# Altium schematic sheet Zynq_Power.SchDoc
size A3
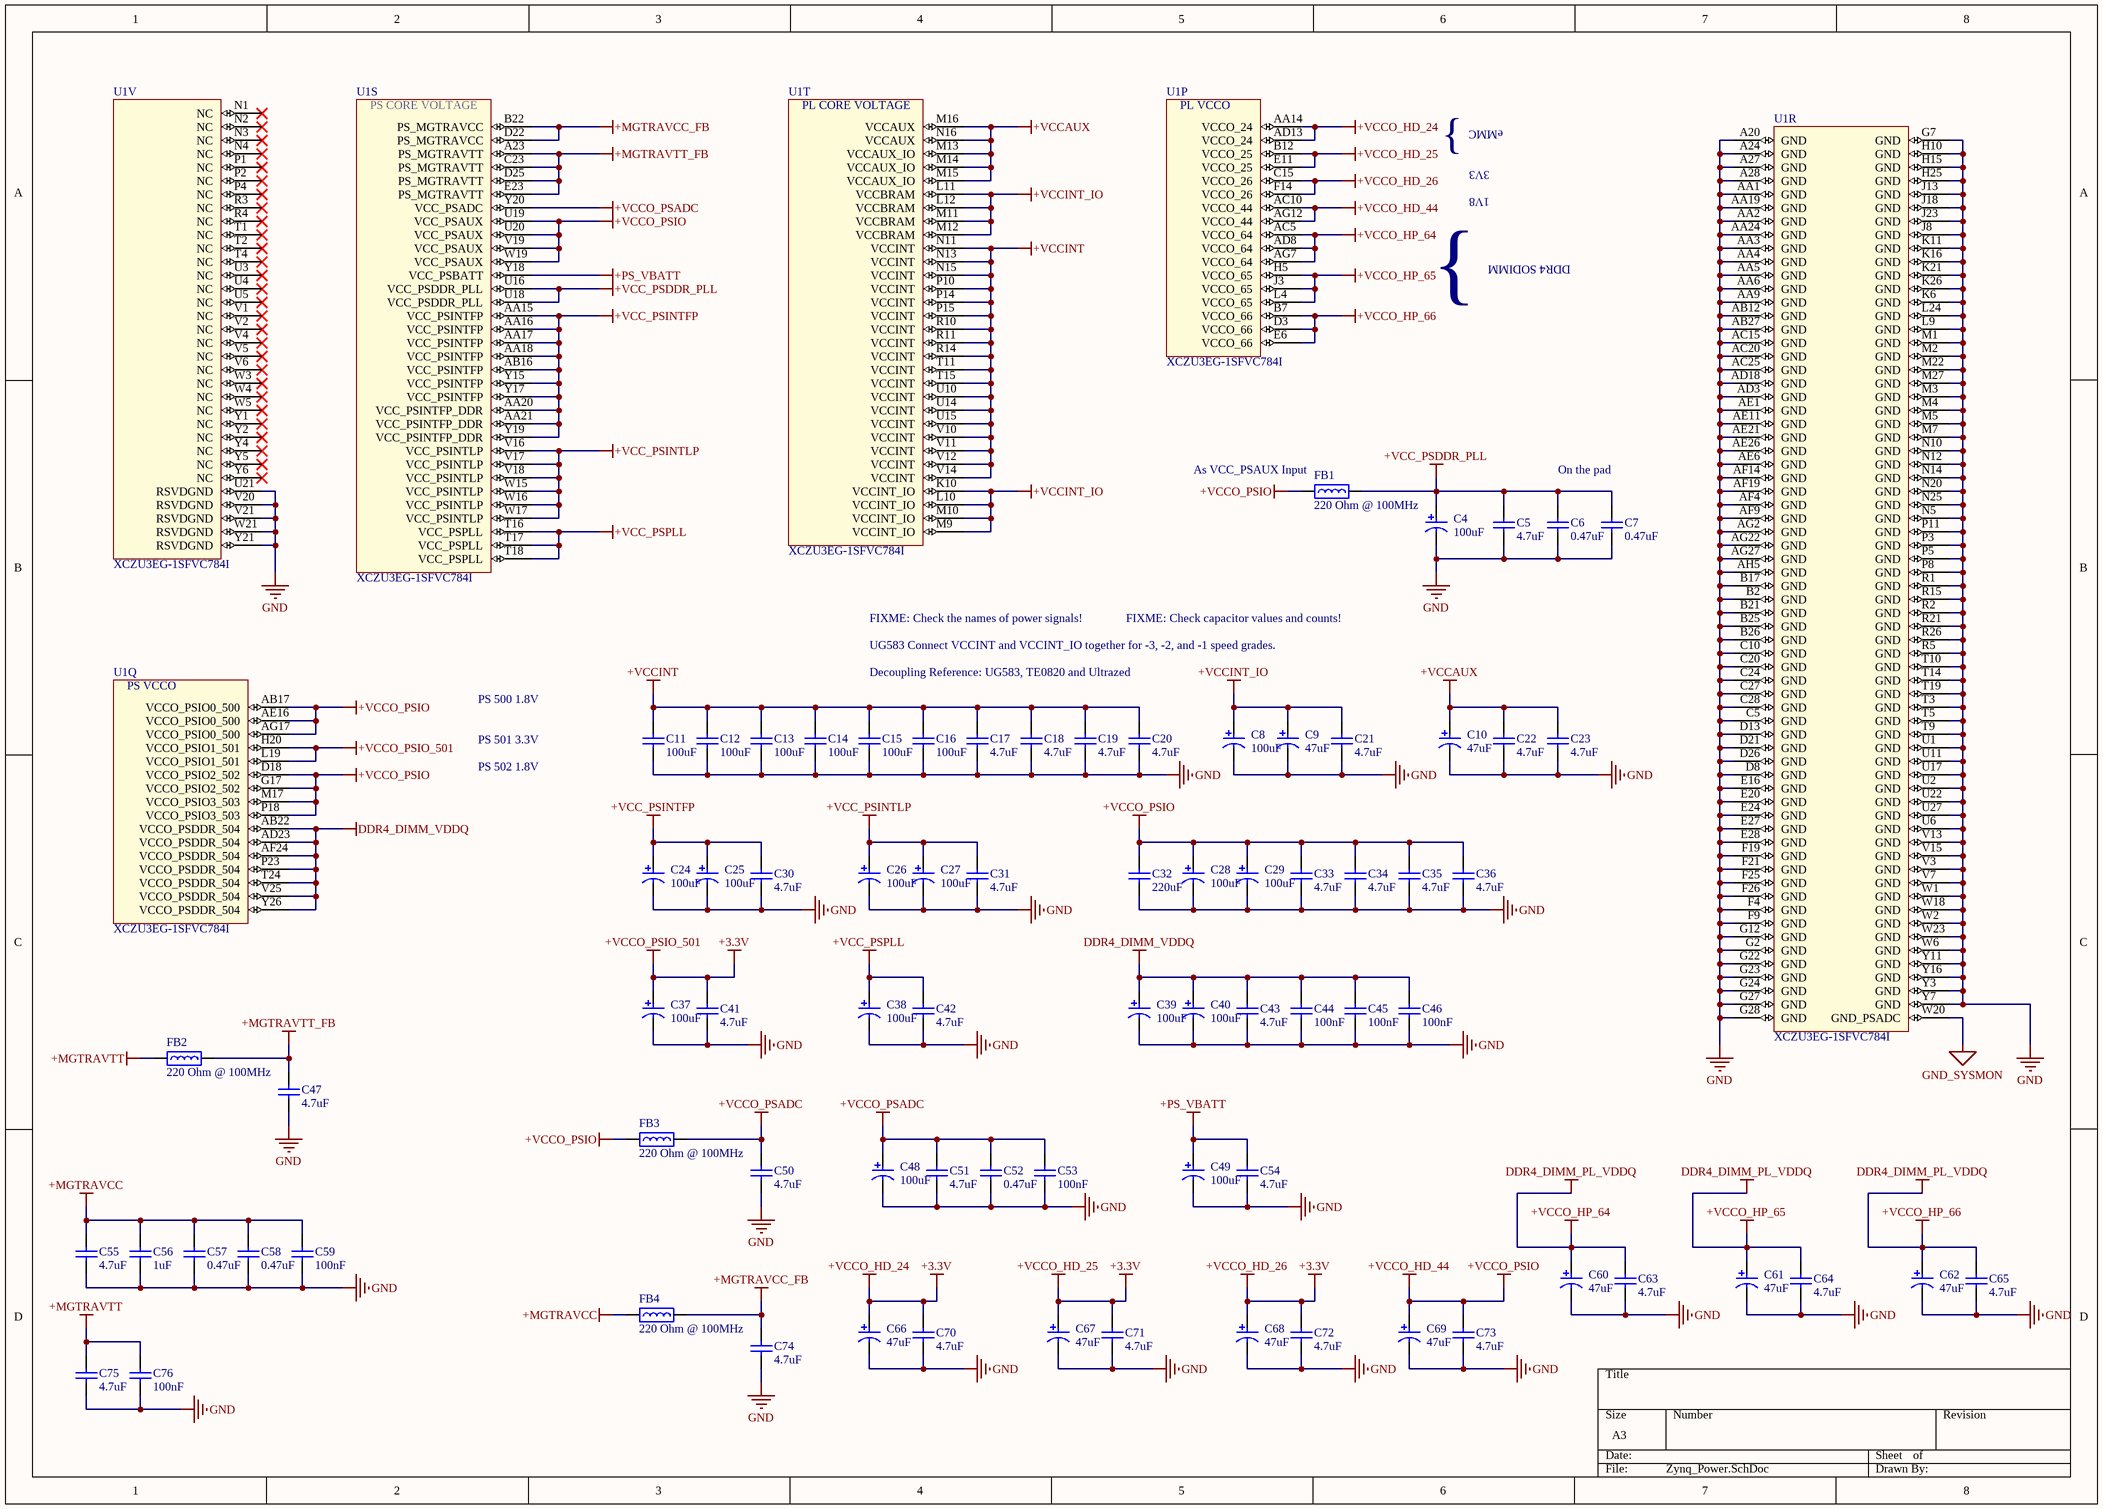
[diagram p0: Zynq_Power.SchDoc]

## Parts
C4  100uF  [AVX_TAN_F95_P_0905]
C5  4.7uF  [CAPC1005L_0402]
C6  0.47uF  [CAPC1005L_0402]
C7  0.47uF  [CAPC1005L_0402]
C8  100uF  [AVX_TAN_F95_P_0905]
C9  47uF  [AVX_TAN_F38_M_0603]
C10  47uF  [AVX_TAN_F38_M_0603]
C11  100uF  [CAPC3225N_1210]
C12  100uF  [CAPC3225N_1210]
C13  100uF  [CAPC3225N_1210]
C14  100uF  [CAPC3225N_1210]
C15  100uF  [CAPC3225N_1210]
C16  100uF  [CAPC3225N_1210]
C17  4.7uF  [CAPC1005L_0402]
C18  4.7uF  [CAPC1005L_0402]
C19  4.7uF  [CAPC1005L_0402]
C20  4.7uF  [CAPC1005L_0402]
C21  4.7uF  [CAPC1005L_0402]
C22  4.7uF  [CAPC1005L_0402]
C23  4.7uF  [CAPC1005L_0402]
C24  100uF  [AVX_TAN_F95_P_0905]
C25  100uF  [AVX_TAN_F95_P_0905]
C26  100uF  [AVX_TAN_F95_P_0905]
C27  100uF  [AVX_TAN_F95_P_0905]
C28  100uF  [AVX_TAN_F95_P_0905]
C29  100uF  [AVX_TAN_F95_P_0905]
C30  4.7uF  [CAPC1005L_0402]
C31  4.7uF  [CAPC1005L_0402]
C32  220uF  [CAPC3225N_1210]
C33  4.7uF  [CAPC1005L_0402]
C34  4.7uF  [CAPC1005L_0402]
C35  4.7uF  [CAPC1005L_0402]
C36  4.7uF  [CAPC1005L_0402]
C37  100uF  [AVX_TAN_F95_P_0905]
C38  100uF  [AVX_TAN_F95_P_0905]
C39  100uF  [AVX_TAN_F95_P_0905]
C40  100uF  [AVX_TAN_F95_P_0905]
C41  4.7uF  [CAPC1005L_0402]
C42  4.7uF  [CAPC1005L_0402]
C43  4.7uF  [CAPC1005L_0402]
C44  100nF  [CAPC1005L_0402]
C45  100nF  [CAPC1005L_0402]
C46  100nF  [CAPC1005L_0402]
C47  4.7uF  [CAPC1005L_0402]
C48  100uF  [AVX_TAN_F95_P_0905]
C49  100uF  [AVX_TAN_F95_P_0905]
C50  4.7uF  [CAPC1005L_0402]
C51  4.7uF  [CAPC1005L_0402]
C52  0.47uF  [CAPC1005L_0402]
C53  100nF  [CAPC1005L_0402]
C54  4.7uF  [CAPC1005L_0402]
C55  4.7uF  [CAPC1005L_0402]
C56  1uF  [CAPC1005L_0402]
C57  0.47uF  [CAPC1005L_0402]
C58  0.47uF  [CAPC1005L_0402]
C59  100nF  [CAPC1005L_0402]
C60  47uF  [AVX_TAN_F38_M_0603]
C61  47uF  [AVX_TAN_F38_M_0603]
C62  47uF  [AVX_TAN_F38_M_0603]
C63  4.7uF  [CAPC1005L_0402]
C64  4.7uF  [CAPC1005L_0402]
C65  4.7uF  [CAPC1005L_0402]
C66  47uF  [AVX_TAN_F38_M_0603]
C67  47uF  [AVX_TAN_F38_M_0603]
C68  47uF  [AVX_TAN_F38_M_0603]
C69  47uF  [AVX_TAN_F38_M_0603]
C70  4.7uF  [CAPC1005L_0402]
C71  4.7uF  [CAPC1005L_0402]
C72  4.7uF  [CAPC1005L_0402]
C73  4.7uF  [CAPC1005L_0402]
C74  4.7uF  [CAPC1005L_0402]
C75  4.7uF  [CAPC1005L_0402]
C76  100nF  [CAPC1005L_0402]
FB1  Impedance @ Frequency: 220 Ohm @ 100MHz  [INDC1608N_0603]  (hidden comment: BEAD0603_220_2A5_40M)
FB2  Impedance @ Frequency: 220 Ohm @ 100MHz  [INDC1608N_0603]  (hidden comment: BEAD0603_220_2A5_40M)
FB3  Impedance @ Frequency: 220 Ohm @ 100MHz  [INDC1608N_0603]  (hidden comment: BEAD0603_220_2A5_40M)
FB4  Impedance @ Frequency: 220 Ohm @ 100MHz  [INDC1608N_0603]  (hidden comment: BEAD0603_220_2A5_40M)
U1  XCZU3EG-1SFVC784I  [BGA784x28]  (parts P,Q,R,S,T,V of 22)

## Nets
+3.3V: C37.1 C41.1 C66.1 C67.1 C68.1 C70.1 C71.1 C72.1 U1.AA14(VCCO_24) U1.AD13(VCCO_24) U1.B12(VCCO_25) U1.C15(VCCO_26) U1.E11(VCCO_25) U1.F14(VCCO_26) U1.H20(VCCO_PSIO1_501) U1.L19(VCCO_PSIO1_501)  [also labelled +VCCO_HD_24, +VCCO_HD_25, +VCCO_HD_26, +VCCO_PSIO_501]
+MGTRAVCC: C55.1 C56.2 C57.2 C58.2 C59.2 FB4.1
+MGTRAVCC_FB: C74.1 FB4.2 U1.B22(PS_MGTRAVCC) U1.D22(PS_MGTRAVCC)
+MGTRAVTT: C75.1 C76.2 FB2.1
+MGTRAVTT_FB: C47.1 FB2.2 U1.A23(PS_MGTRAVTT) U1.C23(PS_MGTRAVTT) U1.D25(PS_MGTRAVTT) U1.E23(PS_MGTRAVTT)
+PS_VBATT: C49.1 C54.1 U1.Y18(VCC_PSBATT)
+VCC_PSDDR_PLL: C4.1 C5.1 C6.2 C7.2 FB1.2 U1.U16(VCC_PSDDR_PLL) U1.U18(VCC_PSDDR_PLL)
+VCC_PSINTFP: C24.1 C25.1 C30.1 U1.AA15(VCC_PSINTFP) U1.AA16(VCC_PSINTFP) U1.AA17(VCC_PSINTFP) U1.AA18(VCC_PSINTFP) U1.AA20(VCC_PSINTFP_DDR) U1.AA21(VCC_PSINTFP_DDR) U1.AB16(VCC_PSINTFP) U1.Y15(VCC_PSINTFP) U1.Y17(VCC_PSINTFP) U1.Y19(VCC_PSINTFP_DDR)
+VCC_PSINTLP: C26.1 C27.1 C31.1 U1.V16(VCC_PSINTLP) U1.V17(VCC_PSINTLP) U1.V18(VCC_PSINTLP) U1.W15(VCC_PSINTLP) U1.W16(VCC_PSINTLP) U1.W17(VCC_PSINTLP)
+VCC_PSPLL: C38.1 C42.1 U1.T16(VCC_PSPLL) U1.T17(VCC_PSPLL) U1.T18(VCC_PSPLL)
+VCCAUX: C10.1 C22.1 C23.1 U1.M13(VCCAUX_IO) U1.M14(VCCAUX_IO) U1.M15(VCCAUX_IO) U1.M16(VCCAUX) U1.N16(VCCAUX)
+VCCINT: C11.2 C12.2 C13.2 C14.2 C15.2 C16.2 C17.2 C18.2 C19.2 C20.2 U1.N11(VCCINT) U1.N13(VCCINT) U1.N15(VCCINT) U1.P10(VCCINT) U1.P14(VCCINT) U1.P15(VCCINT) U1.R10(VCCINT) U1.R11(VCCINT) U1.R14(VCCINT) U1.T11(VCCINT) U1.T15(VCCINT) U1.U10(VCCINT) U1.U14(VCCINT) U1.U15(VCCINT) U1.V10(VCCINT) U1.V11(VCCINT) U1.V12(VCCINT) U1.V14(VCCINT)
+VCCINT_IO: C8.1 C9.1 C21.1 U1.K10(VCCINT_IO) U1.L10(VCCINT_IO) U1.L11(VCCBRAM) U1.L12(VCCBRAM) U1.M9(VCCINT_IO) U1.M10(VCCINT_IO) U1.M11(VCCBRAM) U1.M12(VCCBRAM)
+VCCO_HD_44: C28.1 C29.1 C32.2 C33.1 C34.1 C35.1 C36.1 C69.1 C73.1 FB1.1 FB3.1 U1.AB17(VCCO_PSIO0_500) U1.AC10(VCCO_44) U1.AE16(VCCO_PSIO0_500) U1.AG12(VCCO_44) U1.AG17(VCCO_PSIO0_500) U1.D18(VCCO_PSIO2_502) U1.G17(VCCO_PSIO2_502) U1.M17(VCCO_PSIO3_503) U1.P18(VCCO_PSIO3_503) U1.U19(VCC_PSAUX) U1.U20(VCC_PSAUX) U1.V19(VCC_PSAUX) U1.W19(VCC_PSAUX)  [also labelled +VCCO_PSIO]
+VCCO_HP_64: C60.1 C61.1 C62.1 C63.1 C64.1 C65.1 U1.AC5(VCCO_64) U1.AD8(VCCO_64) U1.AG7(VCCO_64) U1.B7(VCCO_66) U1.D3(VCCO_66) U1.E6(VCCO_66) U1.H5(VCCO_65) U1.J3(VCCO_65) U1.L4(VCCO_65)  [also labelled +VCCO_HP_65, +VCCO_HP_66, DDR4_DIMM_PL_VDDQ]
+VCCO_PSADC: C48.1 C50.1 C51.1 C52.2 C53.2 FB3.2 U1.Y20(VCC_PSADC)
DDR4_DIMM_VDDQ: C39.1 C40.1 C43.1 C44.2 C45.2 C46.2 U1.AB22(VCCO_PSDDR_504) U1.AD23(VCCO_PSDDR_504) U1.AF24(VCCO_PSDDR_504) U1.P23(VCCO_PSDDR_504) U1.T24(VCCO_PSDDR_504) U1.V25(VCCO_PSDDR_504) U1.Y26(VCCO_PSDDR_504)
GND: C4.2 C5.2 C6.1 C7.1 C8.2 C9.2 C10.2 C11.1 C12.1 C13.1 C14.1 C15.1 C16.1 C17.1 C18.1 C19.1 C20.1 C21.2 C22.2 C23.2 C24.2 C25.2 C26.2 C27.2 C28.2 C29.2 C30.2 C31.2 C32.1 C33.2 C34.2 C35.2 C36.2 C37.2 C38.2 C39.2 C40.2 C41.2 C42.2 C43.2 C44.1 C45.1 C46.1 C47.2 C48.2 C49.2 C50.2 C51.2 C52.1 C53.1 C54.2 C55.2 C56.1 C57.1 C58.1 C59.1 C60.2 C61.2 C62.2 C63.2 C64.2 C65.2 C66.2 C67.2 C68.2 C69.2 C70.2 C71.2 C72.2 C73.2 C74.2 C75.2 C76.1 U1.A20(GND) U1.A24(GND) U1.A27(GND) U1.A28(GND) U1.AA1(GND) U1.AA2(GND) U1.AA3(GND) U1.AA4(GND) U1.AA5(GND) U1.AA6(GND) U1.AA9(GND) U1.AA19(GND) U1.AA24(GND) U1.AB12(GND) U1.AB27(GND) U1.AC15(GND) U1.AC20(GND) U1.AC25(GND) U1.AD3(GND) U1.AD18(GND) U1.AE1(GND) U1.AE6(GND) U1.AE11(GND) U1.AE21(GND) U1.AE26(GND) U1.AF4(GND) U1.AF9(GND) U1.AF14(GND) U1.AF19(GND) U1.AG2(GND) U1.AG22(GND) U1.AG27(GND) U1.AH5(GND) U1.B2(GND) U1.B17(GND) U1.B21(GND) U1.B25(GND) U1.B26(GND) U1.C5(GND) U1.C10(GND) U1.C20(GND) U1.C24(GND) U1.C27(GND) U1.C28(GND) U1.D8(GND) U1.D13(GND) U1.D21(GND) U1.D26(GND) U1.E16(GND) U1.E20(GND) U1.E24(GND) U1.E27(GND) U1.E28(GND) U1.F4(GND) U1.F9(GND) U1.F19(GND) U1.F21(GND) U1.F25(GND) U1.F26(GND) U1.G2(GND) U1.G7(GND) U1.G12(GND) U1.G22(GND) U1.G23(GND) U1.G24(GND) U1.G27(GND) U1.G28(GND) U1.H10(GND) U1.H15(GND) U1.H25(GND) U1.J8(GND) U1.J13(GND) U1.J18(GND) U1.J23(GND) U1.K6(GND) U1.K11(GND) U1.K16(GND) U1.K21(GND) U1.K26(GND) U1.L9(GND) U1.L24(GND) U1.M1(GND) U1.M2(GND) U1.M3(GND) U1.M4(GND) U1.M5(GND) U1.M7(GND) U1.M22(GND) U1.M27(GND) U1.N5(GND) U1.N10(GND) U1.N12(GND) U1.N14(GND) U1.N20(GND) U1.N25(GND) U1.P3(GND) U1.P5(GND) U1.P8(GND) U1.P11(GND) U1.R1(GND) U1.R2(GND) U1.R5(GND) U1.R15(GND) U1.R21(GND) U1.R26(GND) U1.T3(GND) U1.T5(GND) U1.T9(GND) U1.T10(GND) U1.T14(GND) U1.T19(GND) U1.U1(GND) U1.U2(GND) U1.U6(GND) U1.U11(GND) U1.U17(GND) U1.U21(RSVDGND) U1.U22(GND) U1.U27(GND) U1.V3(GND) U1.V7(GND) U1.V13(GND) U1.V15(GND) U1.V20(RSVDGND) U1.V21(RSVDGND) U1.W1(GND) U1.W2(GND) U1.W6(GND) U1.W18(GND) U1.W21(RSVDGND) U1.W23(GND) U1.Y3(GND) U1.Y7(GND) U1.Y11(GND) U1.Y16(GND) U1.Y21(RSVDGND)
GND_SYSMON: U1.W20(GND_PSADC)

Not connected (* = marked no-connect by the designer): U1 N1(NC)* N2(NC)* N3(NC)* N4(NC)* P1(NC)* P2(NC)* P4(NC)* R3(NC)* R4(NC)* T1(NC)* T2(NC)* T4(NC)* U3(NC)* U4(NC)* U5(NC)* V1(NC)* V2(NC)* V4(NC)* V5(NC)* V6(NC)* W3(NC)* W4(NC)* W5(NC)* Y1(NC)* Y2(NC)* Y4(NC)* Y5(NC)* Y6(NC)*

## Notes on the sheet
- }
- 3V3
- eMMC
- 1V8
- DDR4 SODIMM
- (near FB1) As VCC_PSAUX Input
- On the pad
- UG583 Connect VCCINT and VCCINT_IO together for -3, -2, and -1 speed grades.
- FIXME: Check the names of power signals!
- FIXME: Check capacitor values and counts!
- PS 500 1.8V
- Decoupling Reference: UG583, TE0820 and Ultrazed
- PS 502 1.8V
- PS 501 3.3V
- (in symbol XCZU3EG-1SFVC784I, part P) PL VCCO
- (in symbol XCZU3EG-1SFVC784I, part Q) PS VCCO
- (in symbol XCZU3EG-1SFVC784I, part S) PS CORE VOLTAGE
- (in symbol XCZU3EG-1SFVC784I, part T) PL CORE VOLTAGE

## Library data of the parts
C4 C8 C24-C29 C37-C40 C48 C49 = CAPELE0905TAN100U6V3_20T: CAP TANT 100UF 6.3V 20% 0805; Manufacturer 1: AVX Corporation; Manufacturer Part Number 1: F950J107MPAAQ2; Temperature Coefficient: Tantalum; ESR: 1.2 Ohm; Package: 0905 P; ComponentLink1Description: Datasheet; ComponentLink1URL: C:\Users\Public\Documents\Altium\AD16\Library\PDF\F95.pdf; Value: 100uF; Voltage: 6.3V; Tolerance: 20%; Supplier 1: Digi-Key; Supplier Part Number 1: 478-8393-1-ND; Operating Temperature: -55°C ~ 125°C
C5 C17-C23 C30 C31 C33-C36 C41-C43 C47 C50 C51 C54 C55 C63-C65 C70-C75 = CAPCER0402X5R4U710V_10T: CAP CER 4.7UF 10V X5R 0402; Manufacturer 1: TDK Corporation; Manufacturer Part Number 1: C1005X5R1A475K050BC; Tolerance: 10%; Package: 0402; ComponentLink1Description: Datasheet; Value: 4.7uF; Voltage: 10V; Temperature Coefficient: x5R; Supplier 1: Digi-Key; Supplier Part Number 1: 445-13820-1-ND; Operating Temperature: -55°C ~ 85°C
C6 C7 C52 C57 C58 = CAPCER0402X5R0U4710V_10T: CAP CER 0.47UF 10V X5R 0402; Manufacturer 1: Murata Electronics North America; Manufacturer Part Number 1: GRM155R61A474KE15D; Tolerance: 10%; Package: 0402; ComponentLink1Description: Datasheet; Value: 0.47uF; Voltage: 10V; Temperature Coefficient: X5R; Supplier 1: Digi-Key; Supplier Part Number 1: 490-3264-1-ND; Operating Temperature: -55°C ~ 85°C
C9 C10 C60-C62 C66-C69 = CAPELE0603TAN47U6V3_20T: CAP TANT POLY 47UF 6.3V SMD; Manufacturer 1: AVX Corporation; Manufacturer Part Number 1: F380J476MMAAXE; Tolerance: 20%; Temperature Coefficient: Tantalum; ESR: 300 mOhm; Package: 0603 M; ComponentLink1Description: Datasheet; ComponentLink1URL: C:\Users\Public\Documents\Altium\AD16\Library\PDF\f38.pdf; Value: 47uF; Voltage: 6.3V; Supplier 1: Digi-Key; Supplier Part Number 1: 478-9399-1-ND; Operating Temperature: -55°C ~ 105°C
C11-C16 = CAPCER1210X5R100U16V_20T: CAP CER 100UF 16V X5R 1210; Manufacturer 1: Taiyo Yuden; Manufacturer Part Number 1: EMK325ABJ107MM-T; Tolerance: 20%; Package: 1210; ComponentLink1Description: Datasheet; Value: 100uF; Voltage: 16V; Temperature Coefficient: X5R; Supplier 1: Digi-Key; Supplier Part Number 1: 587-3152-1-ND; Operating Temperature: -55°C ~ 85°C
C32 = CAPCER1210X5R220U6V3_20T: CAP CER 220UF 6.3V X5R 1210; Manufacturer 1: Samsung Electro-Mechanics America, Inc.; Manufacturer Part Number 1: CL32A227MQVNNNE; Tolerance: 20%; Package: 1210; ComponentLink1Description: Datasheet; Value: 220uF; Voltage: 6.3V; Temperature Coefficient: X5R; Supplier 1: Digi-Key; Supplier Part Number 1: 1276-3375-1-ND; Operating Temperature: -55°C ~ 85°C
C44-C46 C53 C59 C76 = CAPCER0402X7R100N25V_10T: CAP CER 0.1UF 25V X7R 0402; Manufacturer 1: Murata Electronics North America; Manufacturer Part Number 1: GRM155R71E104KE14D; Tolerance: 10%; Package: 0402; ComponentLink1Description: Datasheet; Value: 100nF; Voltage: 25V; Temperature Coefficient: X7R; Supplier 1: Digi-Key; Supplier Part Number 1: 490-10698-1-ND; Operating Temperature: -55°C ~ 125°C
C56 = CAPCER0402X5R1U16V_20T: CAP CER 1UF 16V X5R 0402; Manufacturer 1: Murata Electronics North America; Manufacturer Part Number 1: GRM155R61C105ME01D; Tolerance: 20%; Package: 0402; ComponentLink1Description: Datasheet; Value: 1uF; Voltage: 16V; Temperature Coefficient: X5R; Supplier 1: Digi-Key; Supplier Part Number 1: 490-10454-1-ND; Operating Temperature: -55°C ~ 85°C
FB1-FB4 = BEAD0603_220_2A5_40M: FERRITE BEAD 220 OHM 0603 1LN; Manufacturer 1: Murata Electronics North America; Manufacturer Part Number 1: BLM18SG221TN1D; Current Rating (Max): 2.5A; DC Resistance (DCR) (Max): 40 mohm; Package: 0603; ComponentLink1Description: Datasheet; ComponentLink1URL: C:\Users\Public\Documents\Altium\AD16\Library\PDF\ENFA0003.pdf; Supplier 1: Digi-Key; Supplier Part Number 1: 490-5225-1-ND; Operating Temperature: -55°C ~ 125°C
U1 = XCZU3EG-1SFVC784I: IC FPGA 252 I/O 784FCBGA - XILINX ZYNQ ULTRASCALE+; Manufacturer 1: Xilinx Inc.; Package: SFVC784; ComponentLink1Description: Datasheet; Supplier 1: Digi-Key; Supplier Part Number 1: XCZU3EG-1SFVC784I-ND; Manufacturer Part Number 1: XCZU3EG-1SFVC784I